# Altium schematic sheet BuckConverter.SchDoc
size A
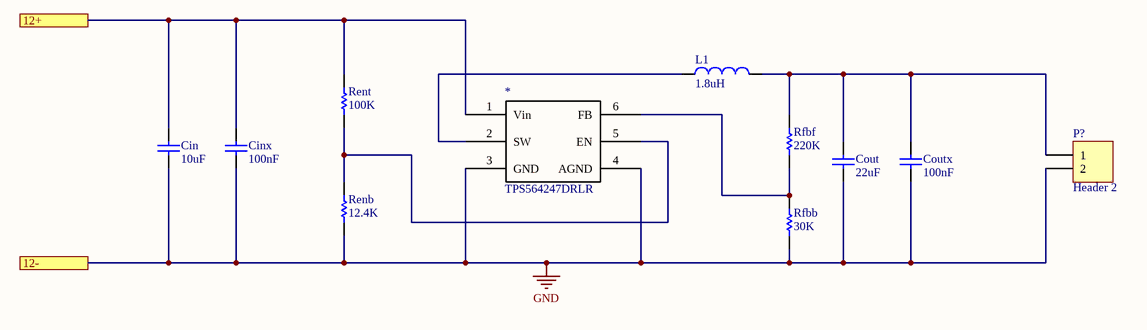
[diagram p0: BuckConverter.SchDoc]

## Parts
*  TPS564247DRLR
Cin  value 10uF  (hidden comment: Capacitor)
Cinx  value 100nF  (hidden comment: Capacitor)
Cout  value 22uF  (hidden comment: Capacitor)
Coutx  value 100nF  (hidden comment: Capacitor)
L1  value 1.8uH  (hidden comment: Inductor)
P?  Header 2  [HDR1X2]
Renb  value 12.4K  (hidden comment: Resistor)
Rent  value 100K  (hidden comment: Resistor)
Rfbb  value 30K  (hidden comment: Resistor)
Rfbf  value 220K  (hidden comment: Resistor)

## Ports
12+, 12-

## Nets
GND: *.3(GND) *.4(AGND) Cin.1 Cinx.1 Cout.2 Coutx.1 P?.2 Renb.1 Rfbb.1 ; port 12-
12+: *.1(Vin) Cin.2 Cinx.2 Rent.2 ; port 12+
Net*_2: *.2(SW) L1.1
Net*_5: *.5(EN) Renb.2 Rent.1
Net*_6: *.6(FB) Rfbb.2 Rfbf.1
NetCout_1: Cout.1 Coutx.2 L1.2 P?.1 Rfbf.2

## Library data of the parts
Cin Cinx Cout Coutx = Capacitor: SimulationGenericComponent: True
L1 = Inductor: SimulationGenericComponent: True
P? = Header 2: Header, 2-Pin; LatestRevisionDate: 17-Jul-2002; LatestRevisionNote: Re-released for DXP Platform.; Publisher: Altium Limited
Renb Rent Rfbb Rfbf = Resistor: TC1: 0; SimulationGenericComponent: True; TC2: 0